# EAGLE design BLEbee-0_7_1 (EAGLE 5.11)
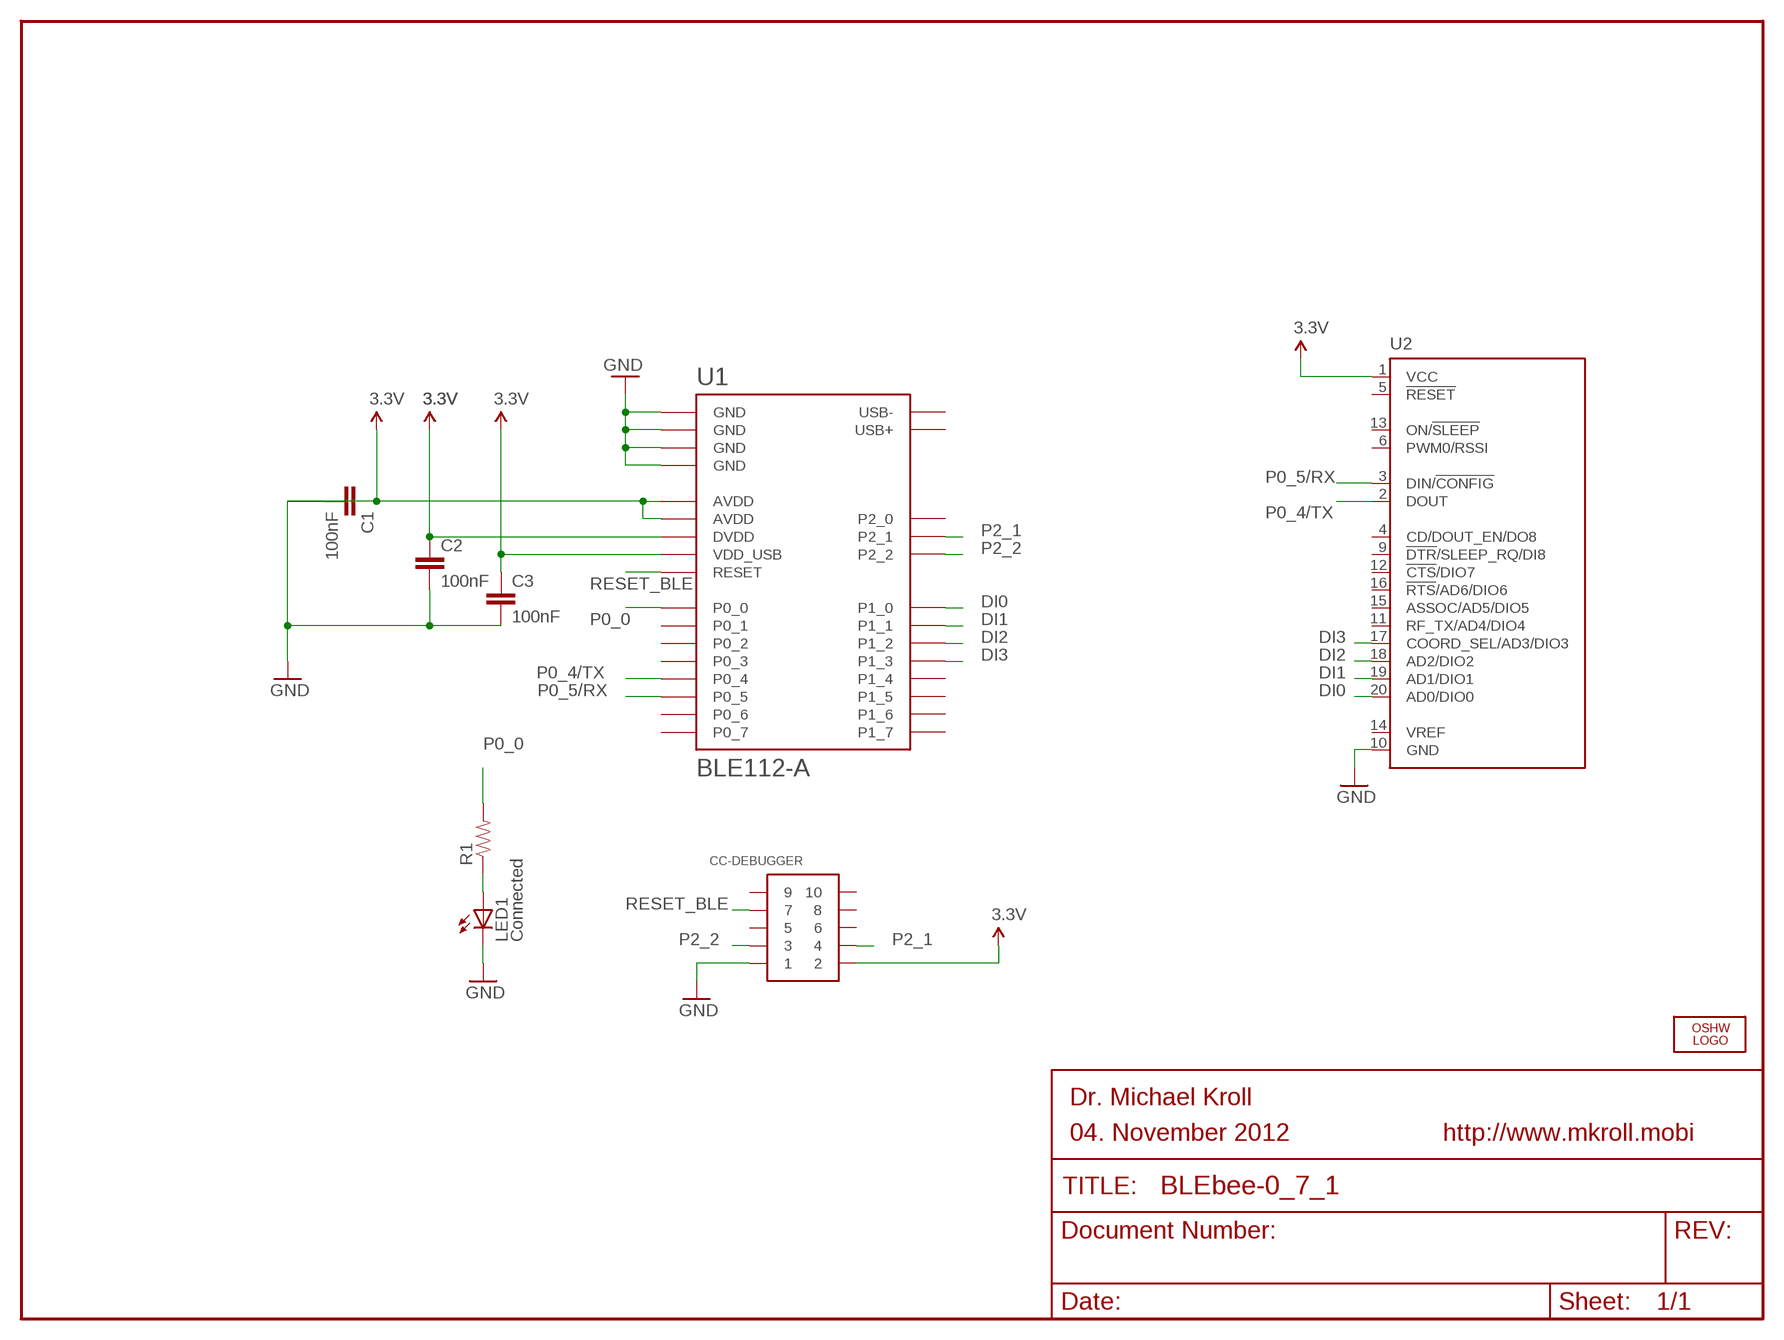
[diagram p0: schematic, sheet 1]

## Parts
C1  100nF  CAP0805  [0805]
C2  100nF  CAP0805  [0805]
C3  100nF  CAP0805  [0805]
CC-DEBUGGER  CONN_5-2-FTSH-V  [FTSH-105-DV]
LED1  Connected  LED1206-BLUE  [LED-1206-BLUE]
LOGO1  LOGO-OSHW-6MILX0100-NT  [OSHW_6X100_NOTEXT]
R1  RESISTOR0805-RES  [0805]
U1  BLE112-A  [BLE112-A]
U2  BEE-XBEE-DIP  [20P-DIP-2.0-W/-SILK]

## Nets
3.3V: C1.1 C2.1 C3.1 CC-DEBUGGER.2 U1.AVDD1(AVDD) U1.AVDD2(AVDD) U1.DVDD U1.VDD_USB U2.1(VCC)
DI0: U1.P1_0 U2.20(AD0/DIO0)
DI1: U1.P1_1 U2.19(AD1/DIO1)
DI2: U1.P1_2 U2.18(AD2/DIO2)
DI3: U1.P1_3 U2.17(COORD_SEL/AD3/DIO3)
GND: C1.2 C2.2 C3.2 CC-DEBUGGER.1 LED1.C U1.GND1(GND) U1.GND2(GND) U1.GND3(GND) U1.GND4(GND) U2.10(GND)
N$1: LED1.A R1.1
P0_0: R1.2 U1.P0_0
P0_4/TX: U1.P0_4 U2.2(DOUT)
P0_5/RX: U1.P0_5 U2.3(DIN/!CONFIG)
P2_1: CC-DEBUGGER.4 U1.P2_1
P2_2: CC-DEBUGGER.3 U1.P2_2
RESET_BLE: CC-DEBUGGER.7 U1.RESET
Unconnected: CC-DEBUGGER.5 CC-DEBUGGER.6 CC-DEBUGGER.8 CC-DEBUGGER.9 CC-DEBUGGER.10 U1.P0_1 U1.P0_2 U1.P0_3 U1.P0_6 U1.P0_7 U1.P1_4 U1.P1_5 U1.P1_6 U1.P1_7 U1.P2_0 U1.USB+ U1.USB- U2.4(CD/DOUT_EN/DO8) U2.5(!RESET) U2.6(PWM0/RSSI) U2.9(!DTR!/SLEEP_RQ/DI8) U2.11(RF_TX/AD4/DIO4) U2.12(!CTS!/DIO7) U2.13(ON/!SLEEP) U2.14(VREF) U2.15(ASSOC/AD5/DIO5) U2.16(!RTS!/AD6/DIO6)

## Notes on the sheet
- Dr. Michael Kroll
- 04. November 2012 | http://www.mkroll.mobi

## Library data of the parts
C1-C3 = SparkFun:CAP: Capacitor Standard 0603 ceramic capacitor, and 0.1" leaded capacitor.
CC-DEBUGGER = pel_misc:CONN_5-2
LED1 = SparkFun:LED: LEDs Standard schematic elements and footprints for 5mm, 3mm, 1206, and 0603 sized LEDs. 5mm - Spark Fun Electronics SKU : COM-00529 (and others)
LOGO1 = Logo:LOGO-OSHW-6MIL
R1 = SparkFun:RESISTOR: Resistor Basic schematic elements and footprints for 0603, 1206, and PTH resistors.
U1 = sf-bluegiga:BLE112-A: Bluetooth Low Energy single-mode module - Bluetooth 4.0, chip antenna
U2 = Module:BEE-XBEE: XBee (TM) /XBee-PRO(TM) OEM RF Modules Source: MaxStream, Inc. xbee_productmanual.pdf

## Board
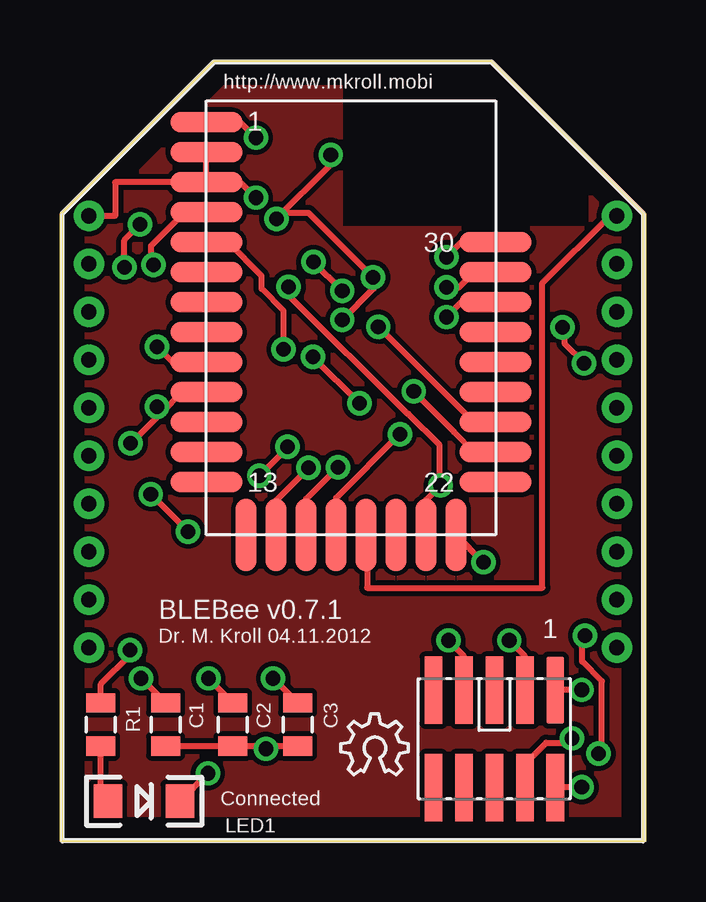
[diagram p1: board, top side]
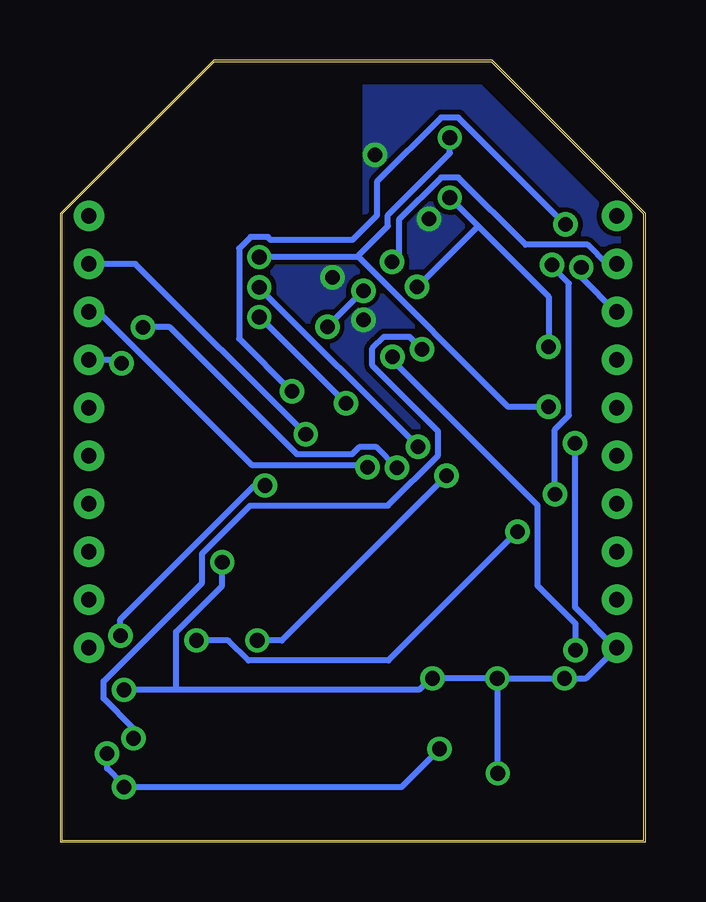
[diagram p2: board, bottom side, seen from below]

Size 24.4 x 32.6 mm. Coordinates in mm from the lower left corner, seen from the top.
Outline: 0,26.2 6.4,32.6 18,32.6 24.4,26.2 24.4,0 0,0 0,26.2
Copper layers (1*16): Top 0.035mm / dielectric 1.5mm / Bottom 0.035mm
Design rules "default": minimum track width 10mil, minimum drill 24mil, track to track 8mil, track to pad 8mil, pad to pad 8mil, via to via 8mil, smd to smd 8mil, copper to edge 40mil, drill to drill 8mil, minimum pad ring 10mil, minimum via ring 8mil, stop-mask expansion 4mil, vias tented up to drill 0mil, thermal gap 10mil
tRestrict: area 11.8,25.7 to 22,32.6
bRestrict: area 11.8,25.7 to 22,32.6

### Footprints (pad centres in the part's own frame; a part is rotated, then mirrored left to right if it is on the bottom)
0805 = smd 0.8 x 1.2: 1 -0.9,0; 2 0.9,0
FTSH-105-DV = smd 0.74 x 2.8: 1 -2.54,-2.03; 2 -2.54,2.03; 3 -1.27,-2.03; 4 -1.27,2.03; 5 0,-2.03; 6 0,2.03; 7 1.27,-2.03; 8 1.27,2.03; 9 2.54,-2.03; 10 2.54,2.03
LED-1206-BLUE = smd 1.2 x 1.4: A -1.5,0; C 1.5,0
BLE112-A = smd 3 x 0.85: AVDD1 -6.05,6.9; AVDD2 -6.05,5.65; GND1 -6.05,8.15; GND2 -6.05,-3.1; GND4 6,3.15; P0_0 6,0.65; P0_1 6,-0.6; P0_2 6,-1.85; P0_3 6,-3.1; P0_4 6,-4.35; P0_5 6,-5.6; P0_6 6,-6.85; P1_5 -6.05,-6.85; P1_6 -6.05,-0.6; P1_7 -6.05,0.65; P2_0 -6.05,1.9; P2_1 -6.05,3.15; P2_2 -6.05,4.4; RESET 6,1.9; USB+ -6.05,-4.35; USB- -6.05,-5.6; VDD_USB -6.05,-1.85 | smd 0.85 x 3: DVDD 3.1,-9.05; GND3 4.35,-9.05; P0_7 1.85,-9.05; P1_0 0.6,-9.05; P1_1 -0.65,-9.05; P1_2 -1.9,-9.05; P1_3 -3.15,-9.05; P1_4 -4.4,-9.05
20P-DIP-2.0-W/-SILK = drill 0.635 pad 1.27 round: 1 -11,9; 2 -11,7; 3 -11,5; 4 -11,3; 5 -11,1; 6 -11,-1; 7 -11,-3; 8 -11,-5; 9 -11,-7; 10 -11,-9; 11 11,-9; 12 11,-7; 13 11,-5; 14 11,-3; 15 11,-1; 16 11,1; 17 11,3; 18 11,5; 19 11,7; 20 11,9

### Placement (x,y rotation side)
C1  4.4,4.9 90 top
C2  7.2,4.9 90 top
C3  9.9,4.9 90 top
CC-DEBUGGER  18.1,4.3 180 top
LED1  3.5,1.7 0 top
LOGO1  11.7,2.8 0 top
R1  1.7,4.9 90 top
U1  12.15,21.85 0 top
U2  12.2,17.1 0 top

### Tracks (layer width: path | path; a pad name or v marks a point on that pad's centre or on a via)
3.3V  (via drill 0.61)
  Top 0.254: U2.1 2.3,26.1 2.3,27.5 U1.AVDD2 | U1.VDD_USB 4.68,20 v4.04,20.64 | v8.16,26.86 7.56,27.46 6.22,27.46 U1.AVDD2 | U1.AVDD2 U1.AVDD1 | C1.1 C2.1 8.58,4 | 8.58,4 C3.1 | v21.74,2.28 CC-DEBUGGER.2 | 8.58,4 v8.58,3.88 | v21.88,8.6 21.76,8.48 21.76,7.52 22.58,6.7 22.58,3.82 v22.44,3.68 | U1.DVDD 15.26,14.26 v15.86,14.86 15.82,14.98 15.82,16.54 14.52,17.84 14.48,17.84 9.52,22.8 v9.52,23.14
  Bottom 0.254: v4.04,20.64 4.04,22.74 6.98,25.68 | 6.98,25.68 v8.16,26.86 | v8.58,3.88 10.18,2.28 v21.74,2.28 21.78,2.4 22.44,3.06 v22.44,3.68 | v15.86,14.86 16.3,14.86 21.88,9.28 v21.88,8.6 | v9.52,23.14 6.98,25.68
DI0
  Top 0.254: U2.20 22.9,26.1 20.1,23.3 20.1,10.6 12.8,10.6 12.8,11.5 12.76,11.62 U1.P1_0
DI1  (via drill 0.61)
  Top 0.254: v14.16,17 11.5,14.34 U1.P1_1
  Bottom 0.254: U2.19 21.26,24.1 v14.16,17
DI2  (via drill 0.61)
  Top 0.254: v11.58,15.62 10.26,14.3 U1.P1_2
  Bottom 0.254: U2.18 22.78,22.1 16.38,15.7 11.66,15.7 v11.58,15.62
DI3  (via drill 0.61)
  Top 0.254: v21.84,19.96 21.02,20.78 21.02,21.38 v20.94,21.46 | v10.36,15.6 9,14.24 U1.P1_3
  Bottom 0.254: U2.17 21.98,20.1 v21.84,19.96 | v20.94,21.46 19.82,21.46 14.52,16.16 12.24,16.16 11.94,16.46 11.22,16.46 v10.36,15.6
GND  (via drill 0.61)
  Top 0.254: v3.38,6.82 C1.2 | v6.18,6.82 C2.2 | v8.88,6.82 C3.2 | LED1.C v6.16,2.86 | v21.74,6.34 CC-DEBUGGER.1 | v2.94,16.62 4.25,17.93 | 4.25,17.93 5.06,18.74 U1.GND2 | v17.64,11.66 U1.GND3 | v16.1,24.38 16.72,25 U1.GND4 | 4.25,17.93 v4.04,18.14 | U1.GND1 7.52,30 v8.16,29.36
  Bottom 0.254: v6.18,6.82 v3.38,6.82 2.48,6.82 U2.10 1.3,8.14 2.94,9.78 v2.94,16.62 | v6.18,6.82 v8.88,6.82 9,6.78 9.44,6.34 19.56,6.34 | v6.16,2.86 6.16,6.7 v6.18,6.82 | 19.56,6.34 v21.74,6.34 | v17.64,11.66 17.64,10.68 19.56,8.76 19.56,6.34 | 11.96,24.38 v16.1,24.38 | 11.96,24.38 5.72,18.14 v4.04,18.14 | v8.16,29.36 8.16,28.72 10.74,26.14 10.74,25.68 11.92,24.5 11.96,24.38
N$1
  Top 0.254: R1.1 1.7,2 LED1.A
N$2
  pour Top: 0.1,26.3 6.4,32.6 17.9,32.6 24.4,26.1 24.4,0.1 24.3,0 0.1,0
N$3  (via drill 0.61)
  Top 0.254: v11.28,28.64 11.2,28.56 11.2,28.16 v9.02,25.98 9.42,26.22 10.36,26.22 v13.04,23.54 13.06,23.42 13.06,23.06 v11.76,21.76
  pour Bottom: 0.1,26.2 0.1,26.3 6.4,32.6 17.9,32.6 24.4,26.1 24.4,0 0.1,0
P0_0  (via drill 0.61)
  Top 0.254: R1.2 1.7,6.58 2.92,7.8 v2.92,8 | v10.54,20.22 v12.48,18.28 | v16.1,21.88 16.72,22.5 U1.P0_0
  Bottom 0.254: v2.92,8 2.92,9.1 4.5,10.68 4.5,14.02 10.54,20.06 v10.54,20.22 | v12.48,18.28 16.08,21.88 v16.1,21.88
P0_4/TX  (via drill 0.61)
  Top 0.254: v10.56,24.18 v11.76,22.98 | v13.26,21.48 17.24,17.5 U1.P0_4
  Bottom 0.254: U2.2 1.62,24.1 2.42,24.9 5,24.9 7.8,27.7 8.52,27.7 10.28,25.94 10.28,24.46 v10.56,24.18 | v11.76,22.98 v13.26,21.48
P0_5/RX  (via drill 0.61)
  Top 0.254: v2.68,23.96 2.68,25.08 v3.34,25.74 | v14.74,18.78 16.42,17.1 16.42,17.08 17.24,16.26 U1.P0_5
  Bottom 0.254: U2.3 1.24,22.1 2.68,23.54 v2.68,23.96 | v3.34,25.74 7.8,30.2 8.52,30.2 11.2,27.52 11.2,26.12 12.22,25.1 15.62,25.1 15.74,25.22 16.46,25.22 16.94,24.74 16.94,20.98 v14.74,18.78
P2_1  (via drill 0.61)
  Top 0.254: v21.34,4.32 21.16,4.14 20.26,4.14 19.38,3.26 CC-DEBUGGER.4 | v9.32,20.54 9.32,22.14 8.4,23.06 8.4,23.6 7,25 U1.P2_1
  Bottom 0.254: v21.34,4.32 21.34,4.74 22.58,5.98 22.58,6.7 18.48,10.8 18.48,12.02 16.48,14.02 10.74,14.02 8.64,16.12 8.64,17.12 11.38,19.86 11.38,20.58 10.9,21.06 9.84,21.06 v9.32,20.54
P2_2  (via drill 0.61)
  Top 0.254: v18.72,8.4 19.36,7.76 CC-DEBUGGER.3 | v5.34,12.94 v3.78,14.5 | v3.9,24.06 3.8,24.16 3.8,24.86 5.18,26.24 U1.P2_2
  Bottom 0.254: v18.72,8.4 17.38,8.4 16.54,7.56 10.72,7.56 v5.34,12.94 | v3.78,14.5 3.78,17.2 3.2,17.78 3.2,23.28 3.9,23.98 v3.9,24.06
RESET_BLE  (via drill 0.61)
  Top 0.254: v16.18,8.4 16.82,7.76 CC-DEBUGGER.7 | v8.3,15.26 9.48,16.44 v9.48,16.48 | v16.1,23.12 16.62,23.12 17.24,23.74 U1.RESET
  Bottom 0.254: v16.18,8.4 15.16,8.4 v8.3,15.26 | v9.48,16.48 16.1,23.1 v16.1,23.12

### Text on the board
tNames: http://www.mkroll.mobi | BLEBee v0.7.1 | 1 | Dr. M. Kroll 04.11.2012